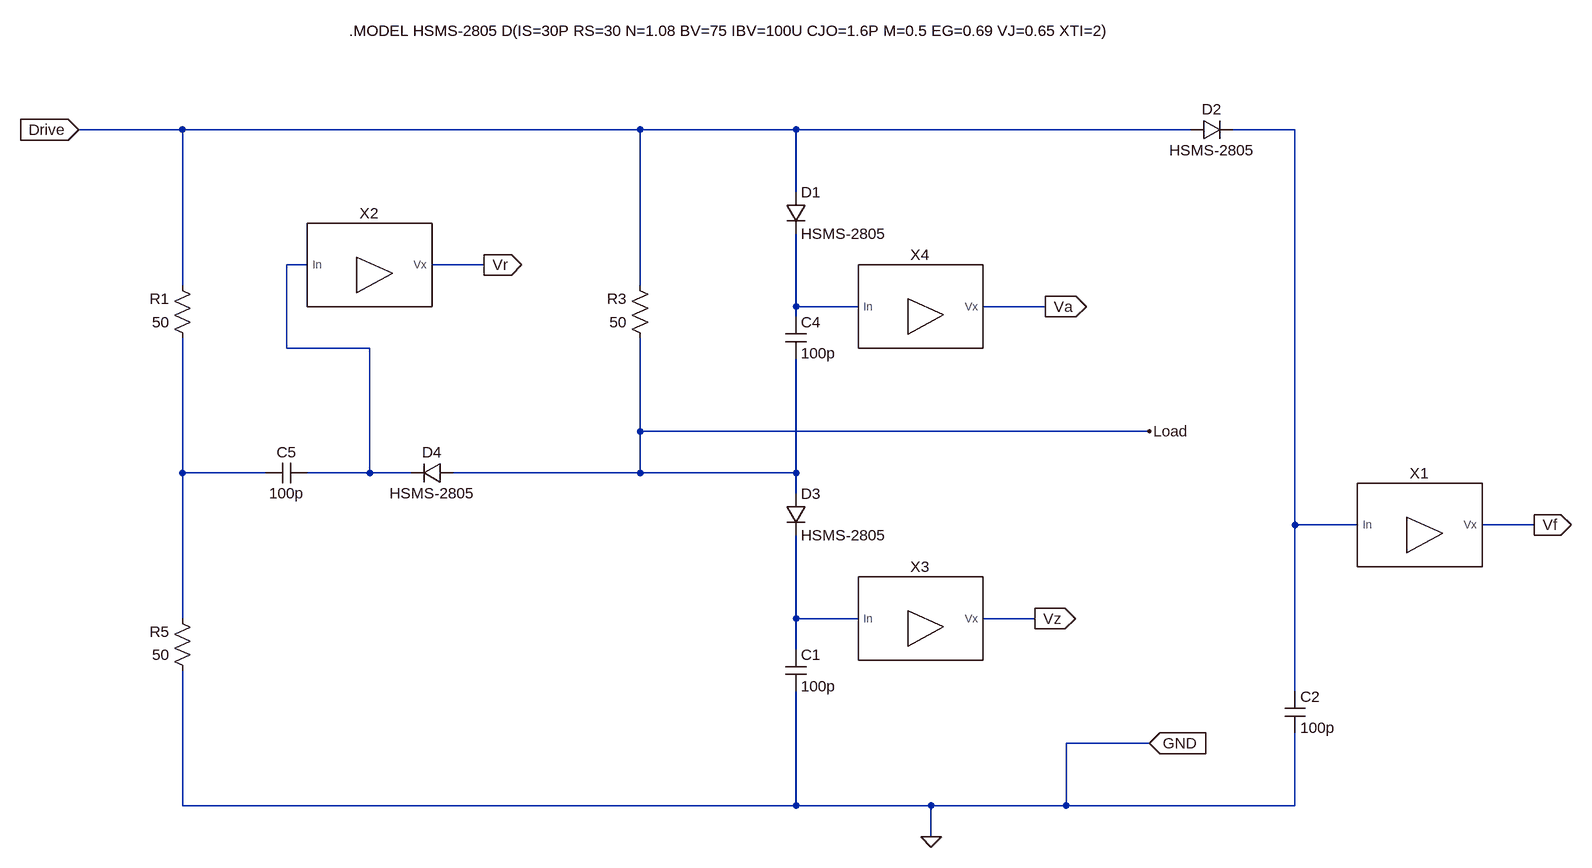
[diagram p0: schematic SARK100Bridge.asc]
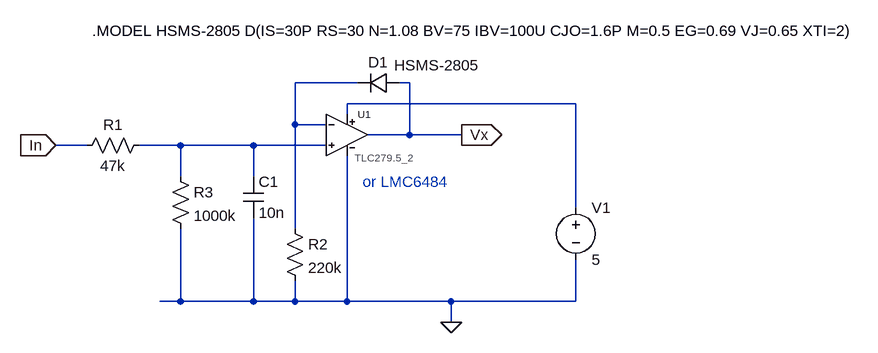
[diagram p1: sub-circuit bridgeamp.asc]
SARK100Bridge.asc, the LTspice schematic file:
Version 4.1
SHEET 1 880 680
WIRE -1968 -736 -2128 -736
WIRE -1264 -736 -1968 -736
WIRE -1024 -736 -1264 -736
WIRE -416 -736 -1024 -736
WIRE -256 -736 -352 -736
WIRE -1024 -640 -1024 -736
WIRE -1776 -528 -1808 -528
WIRE -1504 -528 -1584 -528
WIRE -1968 -496 -1968 -736
WIRE -1264 -496 -1264 -736
WIRE -1024 -464 -1024 -576
WIRE -928 -464 -1024 -464
WIRE -640 -464 -736 -464
WIRE -1024 -448 -1024 -464
WIRE -1808 -400 -1808 -528
WIRE -1680 -400 -1808 -400
WIRE -1264 -272 -1264 -416
WIRE -480 -272 -1264 -272
WIRE -1968 -208 -1968 -416
WIRE -1840 -208 -1968 -208
WIRE -1680 -208 -1680 -400
WIRE -1680 -208 -1776 -208
WIRE -1616 -208 -1680 -208
WIRE -1264 -208 -1264 -272
WIRE -1264 -208 -1552 -208
WIRE -1024 -208 -1024 -384
WIRE -1024 -208 -1264 -208
WIRE -1024 -176 -1024 -208
WIRE -256 -128 -256 -736
WIRE -160 -128 -256 -128
WIRE 112 -128 32 -128
WIRE -1968 16 -1968 -208
WIRE -1024 16 -1024 -112
WIRE -928 16 -1024 16
WIRE -656 16 -736 16
WIRE -1024 64 -1024 16
WIRE -256 128 -256 -128
WIRE -480 208 -608 208
WIRE -1968 304 -1968 96
WIRE -1024 304 -1024 128
WIRE -1024 304 -1968 304
WIRE -816 304 -1024 304
WIRE -608 304 -608 208
WIRE -608 304 -816 304
WIRE -256 304 -256 192
WIRE -256 304 -608 304
WIRE -816 352 -816 304
FLAG 112 -128 Vf
IOPIN 112 -128 Out
FLAG -1504 -528 Vr
IOPIN -1504 -528 Out
FLAG -656 16 Vz
IOPIN -656 16 Out
FLAG -640 -464 Va
IOPIN -640 -464 Out
FLAG -2128 -736 Drive
IOPIN -2128 -736 In
FLAG -480 -272 Load
FLAG -480 208 GND
IOPIN -480 208 In
FLAG -816 352 0
SYMBOL diode -416 -752 M90
WINDOW 0 0 32 VBottom 2
WINDOW 3 32 32 VTop 2
SYMATTR InstName D2
SYMATTR Value HSMS-2805
SYMBOL cap -272 128 R0
SYMATTR InstName C2
SYMATTR Value 100p
SYMBOL BridgeAmp -96 -160 R0
SYMATTR InstName X1
SYMBOL BridgeAmp -1712 -560 R0
SYMATTR InstName X2
SYMBOL BridgeAmp -864 -16 R0
SYMATTR InstName X3
SYMBOL BridgeAmp -864 -496 R0
SYMATTR InstName X4
SYMBOL res -1952 -400 R180
WINDOW 0 36 76 Left 2
WINDOW 3 36 40 Left 2
SYMATTR InstName R1
SYMATTR Value 50
SYMBOL res -1248 -400 R180
WINDOW 0 36 76 Left 2
WINDOW 3 36 40 Left 2
SYMATTR InstName R3
SYMATTR Value 50
SYMBOL res -1952 112 R180
WINDOW 0 36 76 Left 2
WINDOW 3 36 40 Left 2
SYMATTR InstName R5
SYMATTR Value 50
SYMBOL diode -1040 -640 R0
SYMATTR InstName D1
SYMATTR Value HSMS-2805
SYMBOL diode -1040 -176 R0
SYMATTR InstName D3
SYMATTR Value HSMS-2805
SYMBOL diode -1552 -224 R90
WINDOW 0 0 32 VBottom 2
WINDOW 3 32 32 VTop 2
SYMATTR InstName D4
SYMATTR Value HSMS-2805
SYMBOL cap -1040 64 R0
SYMATTR InstName C1
SYMATTR Value 100p
SYMBOL cap -1040 -448 R0
SYMATTR InstName C4
SYMATTR Value 100p
SYMBOL cap -1776 -224 R90
WINDOW 0 0 32 VBottom 2
WINDOW 3 32 32 VTop 2
SYMATTR InstName C5
SYMATTR Value 100p
TEXT -1712 -888 Left 2 !.MODEL HSMS-2805 D(IS=30P RS=30 N=1.08 BV=75 IBV=100U CJO=1.6P M=0.5 EG=0.69 VJ=0.65 XTI=2)

bridgeamp.asc, the sub-circuit schematic file:
Version 4.1
SHEET 1 1092 680
WIRE 240 -48 144 -48
WIRE 320 -48 304 -48
WIRE 576 -16 224 -16
WIRE 224 0 224 -16
WIRE 144 16 144 -48
WIRE 192 16 144 16
WIRE 320 32 320 -48
WIRE 320 32 256 32
WIRE 400 32 320 32
WIRE -176 48 -224 48
WIRE -32 48 -96 48
WIRE 80 48 -32 48
WIRE 192 48 80 48
WIRE -32 96 -32 48
WIRE 80 96 80 48
WIRE 576 144 576 -16
WIRE 144 176 144 16
WIRE -32 288 -32 176
WIRE -32 288 -64 288
WIRE 80 288 80 160
WIRE 80 288 -32 288
WIRE 144 288 144 256
WIRE 144 288 80 288
WIRE 224 288 224 64
WIRE 224 288 144 288
WIRE 384 288 224 288
WIRE 576 288 576 224
WIRE 576 288 384 288
WIRE 384 320 384 288
FLAG 400 32 Vx
IOPIN 400 32 Out
FLAG -224 48 In
IOPIN -224 48 In
FLAG 384 320 0
SYMBOL res -80 32 R90
WINDOW 0 0 56 VBottom 2
WINDOW 3 32 56 VTop 2
SYMATTR InstName R1
SYMATTR Value 47k
SYMBOL res 128 160 R0
SYMATTR InstName R2
SYMATTR Value 220k
SYMBOL diode 304 -64 R90
WINDOW 0 0 32 VBottom 2
WINDOW 3 -27 -58 VTop 2
SYMATTR InstName D1
SYMATTR Value HSMS-2805
SYMBOL res -48 80 R0
SYMATTR InstName R3
SYMATTR Value 1000k
SYMBOL cap 64 96 R0
SYMATTR InstName C1
SYMATTR Value 10n
SYMBOL TLC279.5_2 224 32 R0
SYMATTR InstName U1
SYMBOL voltage 576 128 R0
WINDOW 123 0 0 Left 0
WINDOW 39 0 0 Left 0
SYMATTR InstName V1
SYMATTR Value 5
TEXT 248 104 Left 2 ;or LMC6484
TEXT -168 -128 Left 2 !.MODEL HSMS-2805 D(IS=30P RS=30 N=1.08 BV=75 IBV=100U CJO=1.6P M=0.5 EG=0.69 VJ=0.65 XTI=2)

The netlist it stands for:
* SARK100Bridge.asc
D2 Drive N001 HSMS-2805
C2 N001 0 100p
X§X1 N001 Vf bridgeamp
X§X2 N002 Vr bridgeamp
X§X3 N005 Vz bridgeamp
X§X4 N003 Va bridgeamp
R1 N004 Drive 50
R3 Load Drive 50
R5 0 N004 50
D1 Drive N003 HSMS-2805
D3 Load N005 HSMS-2805
D4 Load N002 HSMS-2805
C1 N005 0 100p
C4 N003 Load 100p
C5 N002 N004 100p

* block symbol definitions
.subckt bridgeamp In Vx
R1 N003 In 47k
R2 N001 0 220k
D1 Vx N001 HSMS-2805
R3 N003 0 1000k
C1 N003 0 10n
X§U1 N003 N001 N002 0 Vx level1 Avol=1Meg GBW=10Meg Vos=0 En=0 Enk=0 In=0 Ink=0 Rin=500Meg  ; pins In+ In- V+ V- OUT
V1 N002 0 5
* or LMC6484
.MODEL HSMS-2805 D(IS=30P RS=30 N=1.08 BV=75 IBV=100U CJO=1.6P M=0.5 EG=0.69 VJ=0.65 XTI=2)
.ends bridgeamp

.model D D
.lib standard.dio
.MODEL HSMS-2805 D(IS=30P RS=30 N=1.08 BV=75 IBV=100U CJO=1.6P M=0.5 EG=0.69 VJ=0.65 XTI=2)
.lib UniversalOpAmp1.lib
.backanno
.end